# Altium project RF Board.PrjPcb
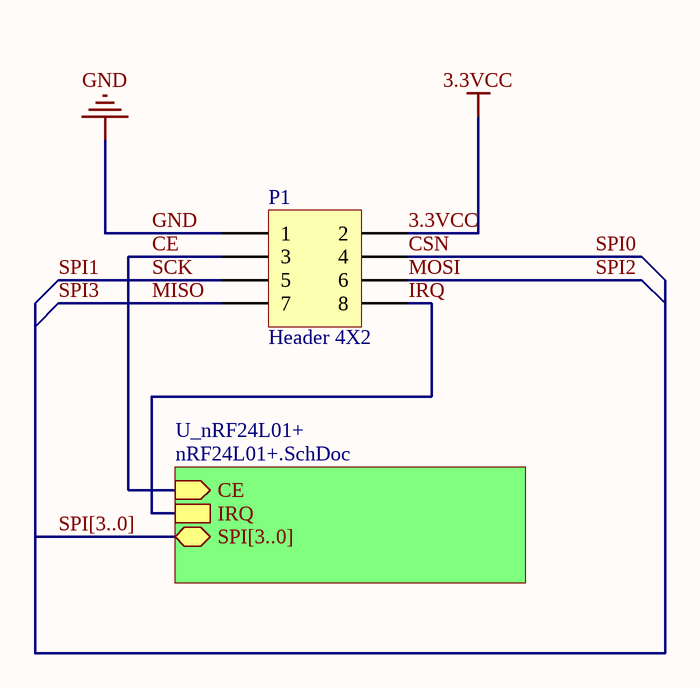
[diagram p0: 2.4Ghz Chip Board.SchDoc]
2 sheets, 17 parts. Net scope: hierarchical (ports join the sheet entries above them; power ports are global).
Board files: RF Board - Commercial China.PcbDoc, RF Board - ECESHOP.PcbDoc
Sheets:
  2.4Ghz Chip Board.SchDoc
    U_nRF24L01+ = nRF24L01+.SchDoc

## Sheet 2.4Ghz Chip Board.SchDoc: 2.4Ghz Chip Board
size Letter

### Parts
P1  Header 4X2  [HDR2X4]

### Sub-sheets
U_nRF24L01+ = nRF24L01+.SchDoc: CE (in), IRQ, SPI[3..0] (bidir)

### Nets
3.3VCC: P1.2
GND: P1.1
CE: P1.3 ; sheet U_nRF24L01+/CE
CSN: P1.4  [also labelled SPI0]
IRQ: P1.8 ; sheet U_nRF24L01+/IRQ
MISO: P1.7  [also labelled SPI3]
MOSI: P1.6  [also labelled SPI2]
SCK: P1.5  [also labelled SPI1]

### Buses and harness runs
bus SPI[3..0] = sheet U_nRF24L01+/SPI[3..0]

### Notes on the sheet
- Title
- Size:
- Date:
- Letter
- Number:
- Time:
- Revision:
- Sheet
- of
- File:

### Library data of the parts
P1 = Header 4X2: Header, 4-Pin, Dual row; LatestRevisionDate: 17-Jul-2002; LatestRevisionNote: Re-released for DXP Platform.; Publisher: Altium Limited

## Sheet nRF24L01+.SchDoc: nRF24L01+ Reference Design
size Letter
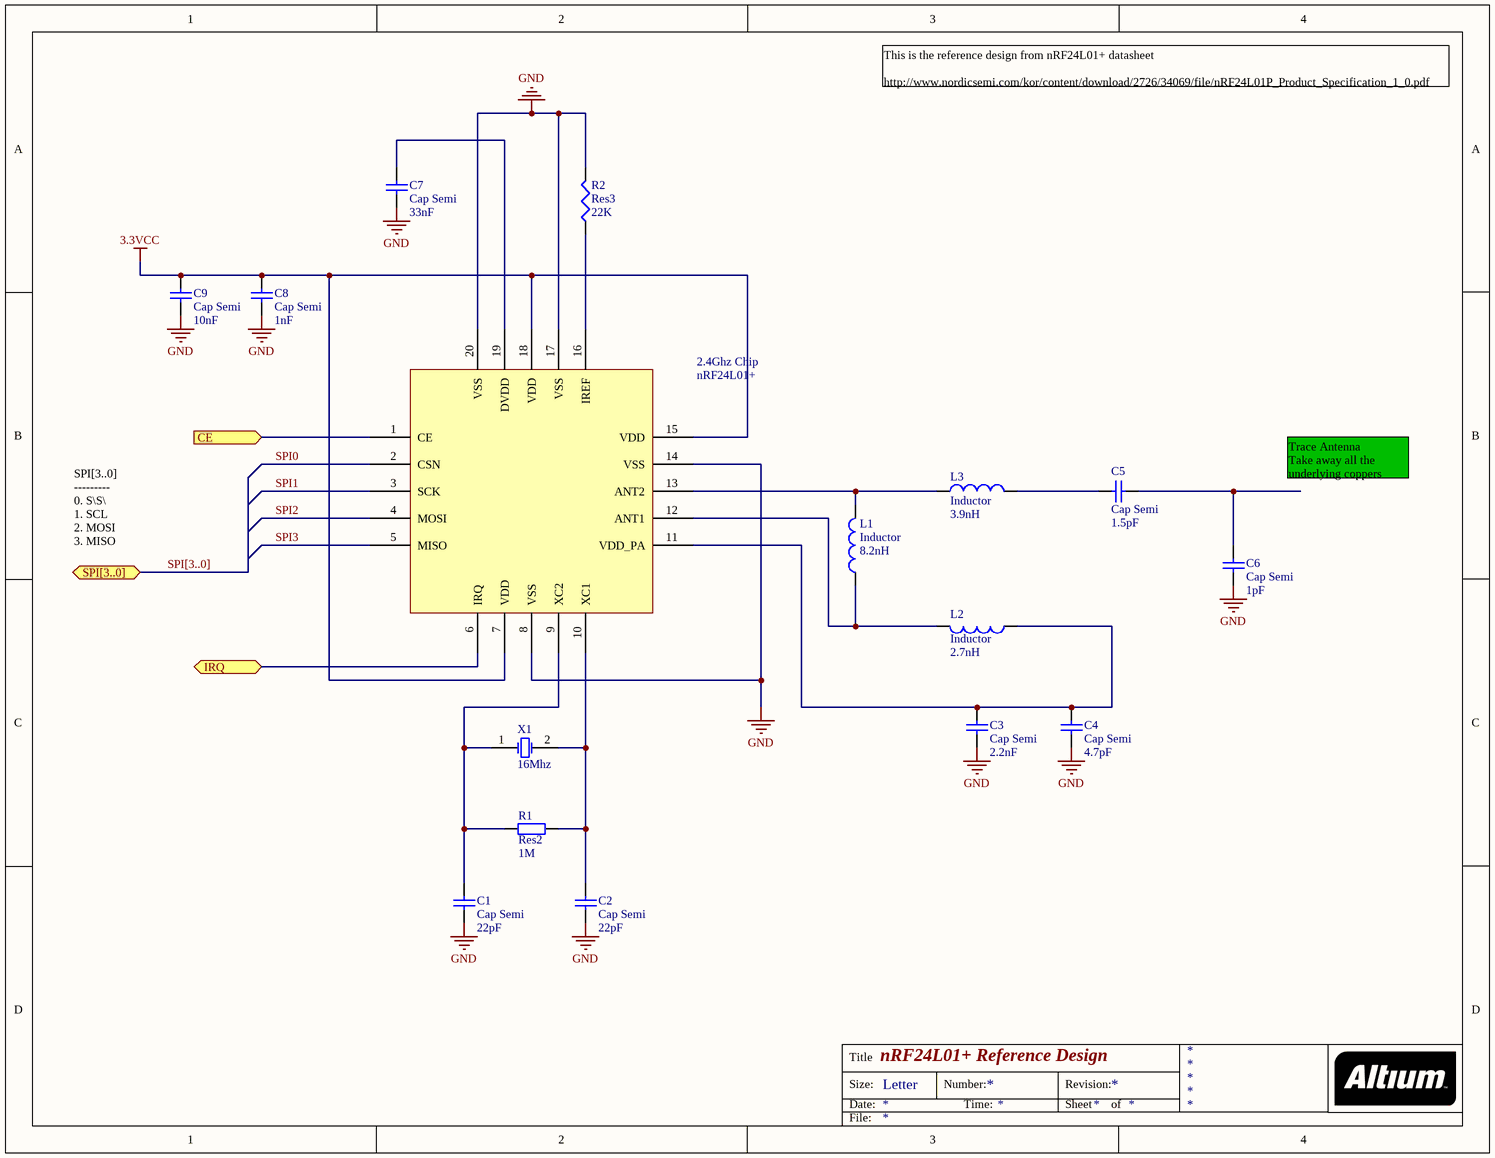
[diagram p1: nRF24L01+.SchDoc]

### Parts
2.4Ghz_Chip  nRF24L01+  [nRF24L01+]
C1  Cap Semi  value 22pF  [CAPC2012N]
C2  Cap Semi  value 22pF  [CAPC2012N]
C3  Cap Semi  value 2.2nF  [CAPC2012N]
C4  Cap Semi  value 4.7pF  [CAPC2012N]
C5  Cap Semi  value 1.5pF  [CAPC2012N]
C6  Cap Semi  value 1pF  [CAPC2012N]
C7  Cap Semi  value 33nF  [CAPC2012N]
C8  Cap Semi  value 1nF  [CAPC2012N]
C9  Cap Semi  value 10nF  [CAPC2012N]
L1  Inductor  value 8.2nH  [INDC1608N]
L2  Inductor  value 2.7nH  [INDC1608N]
L3  Inductor  value 3.9nH  [INDC1608N]
R1  Res2  value 1M  [RESC2012N]
R2  Res3  value 22K  [RESC2012N]
X1  16Mhz  [HC-49U - Through Hole]

### Ports
CE (in), IRQ, SPI[3..0] (bidir)

### Nets
3.3VCC: 2.4Ghz_Chip.7(VDD) 2.4Ghz_Chip.15(VDD) 2.4Ghz_Chip.18(VDD) C8.2 C9.2
GND: 2.4Ghz_Chip.8(VSS) 2.4Ghz_Chip.14(VSS) 2.4Ghz_Chip.17(VSS) 2.4Ghz_Chip.20(VSS) C1.1 C2.1 C3.1 C4.1 C6.1 C7.1 C8.1 C9.1 R2.2
CE: 2.4Ghz_Chip.1(CE) ; port CE
IRQ: 2.4Ghz_Chip.6(IRQ) ; port IRQ
SPI0: 2.4Ghz_Chip.2(CSN)  [project net CSN]
SPI1: 2.4Ghz_Chip.3(SCK)  [project net SCK]
SPI2: 2.4Ghz_Chip.4(MOSI)  [project net MOSI]
SPI3: 2.4Ghz_Chip.5(MISO)  [project net MISO]
Net2.4Ghz_Chip_9: 2.4Ghz_Chip.9(XC2) C1.2 R1.1 X1.1(OSC1)
Net2.4Ghz_Chip_10: 2.4Ghz_Chip.10(XC1) C2.2 R1.2 X1.2(OSC2)
Net2.4Ghz_Chip_11: 2.4Ghz_Chip.11(VDD_PA) C3.2 C4.2 L2.1
Net2.4Ghz_Chip_12: 2.4Ghz_Chip.12(ANT1) L1.1 L2.2
Net2.4Ghz_Chip_13: 2.4Ghz_Chip.13(ANT2) L1.2 L3.1
Net2.4Ghz_Chip_16: 2.4Ghz_Chip.16(IREF) R2.1
Net2.4Ghz_Chip_19: 2.4Ghz_Chip.19(DVDD) C7.2
NetC5_1: C5.1 C6.2
NetC5_2: C5.2 L3.2

### Buses and harness runs
bus SPI[3..0] = port SPI[3..0]

### Notes on the sheet
- This is the reference design from nRF24L01+ datasheet
  http://www.nordicsemi.com/kor/content/download/2726/34069/file/nRF24L01P_Product_Specification_1_0.pdf
- Trace Antenna
  Take away all the underlying coppers (both side) from this area
- SPI[3..0]
  ---------
  0. S\S\
  1. SCL
  2. MOSI
  3. MISO
- Title
- Size:
- Date:
- Letter
- Number:
- Time:
- Revision:
- Sheet
- of
- File:

### Library data of the parts
C1-C9 = Cap Semi: Capacitor (Semiconductor SIM Model); Published: 8-Jun-2000; LatestRevisionDate: 29-May-2009; LatestRevisionNote: IPC-7351 Footprint Added.; PackageReference: C1206; Publisher: Altium Limited; PackageDescription: Chip Capacitor
L1-L3 = Inductor: Code_IEC: 1005; Published: 8-Jun-2000; LatestRevisionDate: 29-May-2009; LatestRevisionNote: IPC-7351 Footprint Added.; PackageReference: 0402-A; Publisher: Altium Limited; PackageDescription: Chip Inductor; Code_JEITA: 0402
R1 = Res2: Resistor; Published: 8-Jun-2000; LatestRevisionDate: 17-Jul-2002; LatestRevisionNote: Re-released for DXP Platform.; PackageReference: AXIAL-0.4; Publisher: Altium Limited; PackageDescription: Axial Device, Thru-Hole; 2 Leads; 0.4 in Pin Spacing
R2 = Res3: Resistor; Published: 8-Jun-2000; LatestRevisionDate: 29-May-2009; LatestRevisionNote: IPC-7351 Footprint Added.; PackageReference: J1-0603; Publisher: Altium Limited; PackageDescription: Chip Resistor
X1 = XTAL: Crystal Oscillator; Published: 8-Jun-2000; LatestRevisionDate: 17-Jul-2002; LatestRevisionNote: Re-released for DXP Platform.; PackageReference: R38; Publisher: Altium Limited; PackageDescription: Crystal, Thru-Hole; 2 Leads; Body 3.1 x 8.2 mm (Dia.xH)

## Nets that join several sheets
3.3VCC: 2.4Ghz Chip Board (P1.2), nRF24L01+ (5 pins)
GND: 2.4Ghz Chip Board (P1.1), nRF24L01+ (13 pins)
CE: 2.4Ghz Chip Board (P1.3), nRF24L01+ (2.4Ghz_Chip.1)
CSN: 2.4Ghz Chip Board (P1.4), nRF24L01+ (2.4Ghz_Chip.2)
IRQ: 2.4Ghz Chip Board (P1.8), nRF24L01+ (2.4Ghz_Chip.6)
MISO: 2.4Ghz Chip Board (P1.7), nRF24L01+ (2.4Ghz_Chip.5)
MOSI: 2.4Ghz Chip Board (P1.6), nRF24L01+ (2.4Ghz_Chip.4)
SCK: 2.4Ghz Chip Board (P1.5), nRF24L01+ (2.4Ghz_Chip.3)